# Altium schematic sheet sch smart home.SchDoc
size A; SheetNumber: 1; SheetTotal: 1
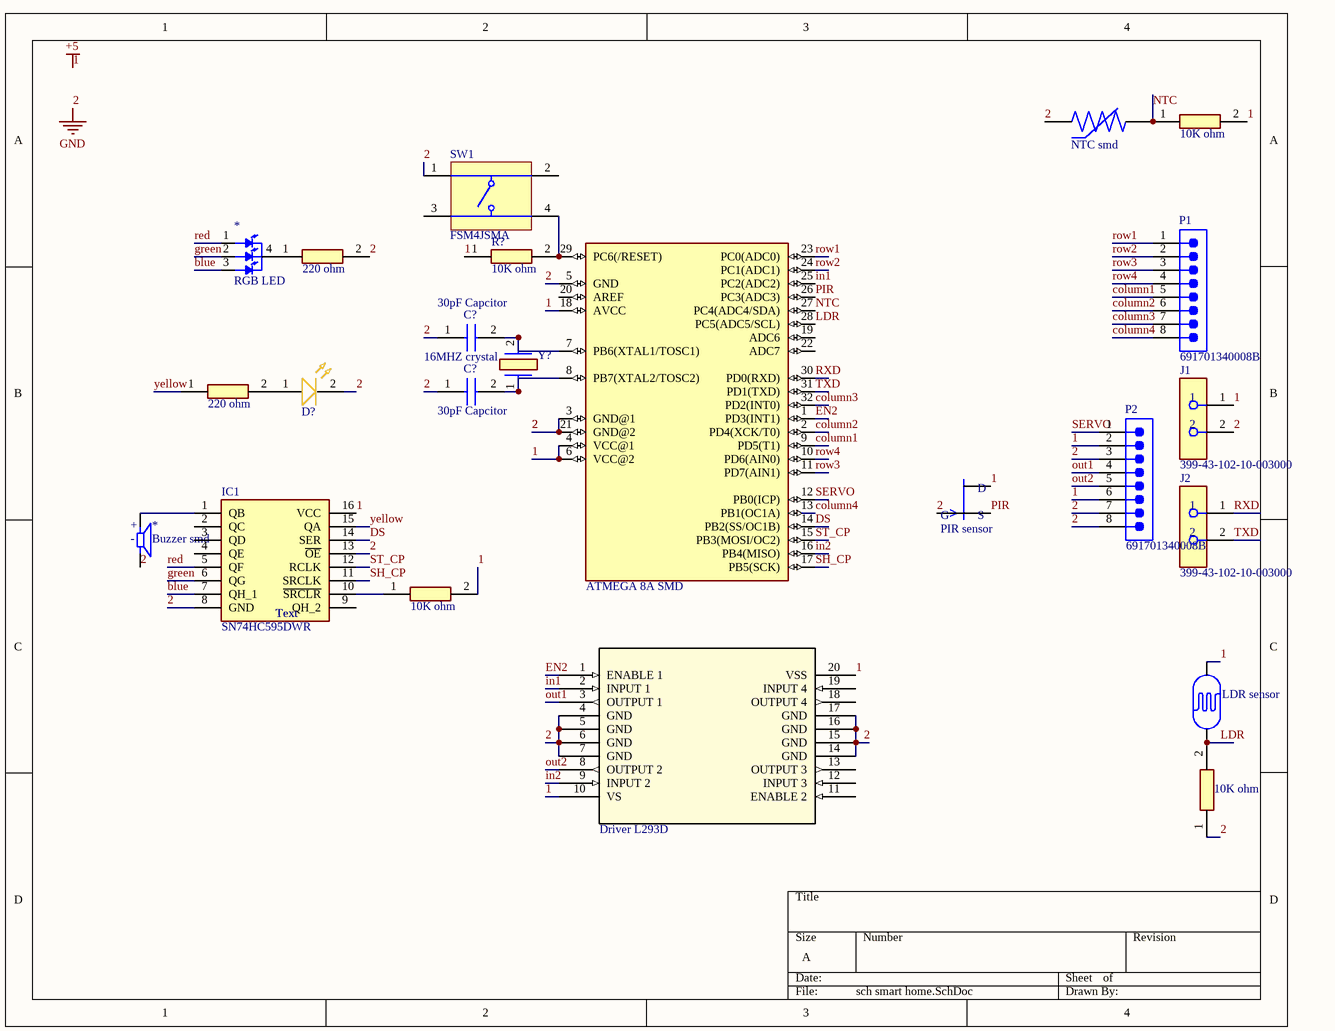
[diagram p0: sch smart home.SchDoc]

## Parts
(Parts that share a designator on the sheet are numbered #1, #2 ... from top to bottom, then left to right.)
*#1  NTC smd  [NTC smd]
*#2  RGB LED  [RGB LED]
*#3  ATMEGA 8A SMD  [ATMEGA 8A SMD]
*#4  PIR sensor  [PIR sensor]
*#5  Buzzer smd  [buzzer smd]
*#6  LDR sensor  [LDR sensor]
*#7  Driver L293D  [L293D]
C?#1  30pF Capcitor  [30pF Capcitor]
C?#2  30pF Capcitor  [30pF Capcitor]
D?  LED  [LED]  (value not drawn)
IC1  SN74HC595DWR  [HC595N]
J1  399-43-102-10-003000  [FP-399-43-102-10-003000-MFG]
J2  399-43-102-10-003000  [FP-399-43-102-10-003000-MFG]
P1  691701340008B  [691701340008B]
P2  691701340008B  [691701340008B]
R#1  10K ohm  [10k OHM]
R#2  220 ohm  [220 OHM]
R#3  220 ohm  [220 OHM]
R#4  10K ohm  [10k OHM]
R#5  10K ohm  [10k OHM]
R?  10K ohm  [10k OHM]
SW1  FSM4JSMA  [TECO-FSM4JSMA_V]
Y?  16MHZ crystal  [16MHZ crystal]

## Nets
1: *#3.4(VCC@1) *#3.6(VCC@2) *#3.18(AVCC) *#4.1(D) *#6.2 *#7.10(VS) *#7.20(VSS) IC1.16(VCC) J1.1 P2.2 P2.6 R#1.2 R#4.2 R?.1  [also labelled +5]
2: *#1.1 *#3.3(GND@1) *#3.5(GND) *#3.21(GND@2) *#4.3(G) *#5.2(N) *#7.4(GND) *#7.5(GND) *#7.6(GND) *#7.7(GND) *#7.14(GND) *#7.15(GND) *#7.16(GND) *#7.17(GND) C?#1.1 C?#2.1 D?.2 IC1.8(GND) IC1.13(~{OE}) J1.2 P2.3 P2.7 P2.8 R#2.2 R#5.1 SW1.1  [also labelled GND]
blue: *#2.3(BLUE) IC1.7(QH_1)
column1: *#3.9(PD5(T1)) P1.5
column2: *#3.2(PD4(XCK/T0)) P1.6
column3: *#3.32(PD2(INT0)) P1.7
column4: *#3.13(PB1(OC1A)) P1.8
DS: *#3.14(PB2(SS/OC1B)) IC1.14(SER)
EN2: *#3.1(PD3(INT1)) *#7.1(ENABLE_1)
green: *#2.2(GREEN) IC1.6(QG)
in1: *#3.25(PC2(ADC2)) *#7.2(INPUT_1)
in2: *#3.16(PB4(MISO)) *#7.9(INPUT_2)
LDR: *#3.28(PC5(ADC5/SCL)) *#6.1 R#5.2
NTC: *#1.2 *#3.27(PC4(ADC4/SDA)) R#1.1
out1: *#7.3(OUTPUT_1) P2.4
out2: *#7.8(OUTPUT_2) P2.5
PIR: *#3.26(PC3(ADC3)) *#4.2(S)
red: *#2.1(RED) IC1.5(QF)
row1: *#3.23(PC0(ADC0)) P1.1
row2: *#3.24(PC1(ADC1)) P1.2
row3: *#3.11(PD7(AIN1)) P1.3
row4: *#3.10(PD6(AIN0)) P1.4
RXD: *#3.30(PD0(RXD)) J2.1
SERVO: *#3.12(PB0(ICP)) P2.1
SH_CP: *#3.17(PB5(SCK)) IC1.11(SRCLK)
ST_CP: *#3.15(PB3(MOSI/OC2)) IC1.12(RCLK)
TXD: *#3.31(PD1(TXD)) J2.2
yellow: IC1.15(QA) R#3.1
Net*#2_4: *#2.4(CATHODE) R#2.1
Net*#3_7: *#3.7(PB6(XTAL1/TOSC1)) C?#1.2 Y?.2
Net*#3_8: *#3.8(PB7(XTAL2/TOSC2)) C?#2.2 Y?.1
Net*#3_29: *#3.29(PC6(/RESET)) R?.2 SW1.4
Net*#5_1: *#5.1(P) IC1.1(QB)
NetD?_1: D?.1 R#3.2
NetIC1_10: IC1.10(~{SRCLR}) R#4.1

Not connected (* = marked no-connect by the designer): *#3 19(ADC6) 20(AREF) 22(ADC7); *#7 11(ENABLE_2) 12(INPUT_3) 13(OUTPUT_3) 18(OUTPUT_4) 19(INPUT_4); IC1 2(QC) 3(QD) 4(QE) 9(QH_2); SW1 2 3

## Notes on the sheet
- (near IC1) Text
- (in symbol Buzzer smd) +; -

## Library data of the parts
*#1 = NTC smd: Manufacturer:: Panasonic Electronic Components; Manufacturer Part Number:: ERT-JZEG103FA; Supplier:: Ultra Librarian; Supplier Part Number:: P124053DKR-ND
*#2 = RGB LED: LED RGB 0404 SMD; Manufacturer:: Cree LED; Manufacturer Product Number:: UHD1110-FKA-CL1A13R3Q1BBQFMF3; Supplier Part Number: UHD1110-FKA-CL1A13R3Q1BBQFMF3DKR-ND; Supplier: SnapMagic
*#4 = PIR sensor: Manufacturer: Zilog; Manufacturer Product Number: ZRE200GE; Supplier:: SnapMagic; Supplier Part Number: 269-4955-ND
*#5 = Buzzer smd: Manufacturer: Murata Electronics; Manufacturer Product Number: PKMCS0909E4000-R1; Supplier: Ultra Librarian; Supplier Part Number: 490-9647-6-ND
*#6 = LDR sensor: PHOTO CELL (CDS PHOTORESISTOR); Manufacturer: Adafruit Industries LLC; Manufacturer Product Number: 161; Supplier: SnapMagic; Supplier Part Number: 1528-2141-ND
*#7 = Driver L293D: IC MTR DRV BIPOLR 4.5-36V 20SOIC; Manufacturer:: STMmicroelectronics; Manufacturer Product Number:: L293DD; Supplier part number: 497-1390-5-ND; Supplier: Ultra librarian
C?#1 C?#2 = 30pF Capcitor: Capacitor; Manufacturer_Name: Kyocera AVX; Manufacturer_Part_Number: 06031A300FAT2A; Datasheet Link: https://componentsearchengine.com/Datasheets/1/06031A100FAT2A.pdf; Height: 0.9mm; Mouser Part Number: 581-06031A300FAT2A; Mouser Price/Stock: https://www.mouser.co.uk/ProductDetail/KYOCERA-AVX/06031A300FAT2A?qs=0IpgBZdgZcpQvPd025dd0w%3D%3D
D? = LED: LED YELLOW CLEAR 0603 SMD; Manufacturer Part Number: 150060AS75000; Manufacturer: Wurth Elektronik; Match Code: WL-SMCW; Case/Size Code: 0603; Chip Technology: AlInGaP; Dominant Wavelength: 605nm; Emitting Color: Amber; Forward Voltage: 2V; Luminous Intensity: 130mcd; Peak Wavelength: 610nm; Viewing Angle: 140°; Category: Signal LEDs; ComponentLink1Description: Website Link; ComponentLink1URL: https://www.we-online.com/redexpert/article/150060AS75000?ad; ComponentLink2Description: Datasheet Link; ComponentLink2URL: https://www.we-online.com/redexpert/spec/150060AS75000?ad; Mount: Surface Mount; Operating Temperature Max: 85°C; Operating Temperature Min: -40°C; Packaging: Tape and Reel; Length: 1.6mm; Width: 0.8mm; Height: 0.7mm; Supplier: SnapMagic; Supplier part Number: 732-12013-6-ND
IC1 = SN74HC595DWR: Integrated Circuit; Manufacturer_Name: Texas Instruments; Manufacturer_Part_Number: SN74HC595DWR; Mouser Part Number: 595-SN74HC595DWR; Supplier Part Number: SN74HC595DWR; Supplier: Texas Instruments
J1 J2 = CMP-07791-000017-1: CONN RCPT 2POS 0.1 GOLD PCB R/A; Pitch: 0.1inch; Connector Type: Receptacle; Number of Positions: 2; Mount: Through Hole; Packaging: Bulk; Color: Black; RoHS Compliant: Yes; Termination: Solder; Number of Rows: 1; Contact Plating: Gold; Package Quantity: 1
P1 P2 = CMP-1502-02009-2: NexarPartId: 22866725; Voltage Rating: 300V; Number of Contacts: 8; Current Rating: 10A; Connector Type: Terminal Block; Gender: Male; REACH SVHC: Unknown; Contact Plating: Tin; RoHS: Compliant; Lead Pitch: 3.81mm; Housing Material: Polymer; Mount: Through Hole; Contact Material: Brass; Termination: PCB; Packaging: Tape and Reel; Color: Black; Number of Pins: 8
R#1 R#4 R#5 R? = 10K ohm: Resistor; Manufacturer_Name: Bourns; Manufacturer_Part_Number: CR2512AJW-103ELF; Datasheet Link: https://www.bourns.com/docs/product-datasheets/crxxxxa.pdf; Height: 0.7mm; Mouser Part Number: 652-CR2512AJW-103ELF; Mouser Price/Stock: https://www.mouser.co.uk/ProductDetail/Bourns/CR2512AJW-103ELF?qs=GedFDFLaBXEqggePGBQmuQ%3D%3D
R#2 R#3 = 220 ohm: Resistor; Manufacturer_Name: Walsin Technology Corporation; Manufacturer_Part_Number: WR08X2200FTL; Datasheet Link: https://www.arrow.com/en/products/wr08x2200ftl/walsin-technology; Arrow Part Number: WR08X2200FTL; Arrow Price/Stock: https://www.arrow.com/en/products/wr08x2200ftl/walsin-technology
SW1 = CMP-2000-05602-2: Swicth, SPST, 24 V, -35 to 85 degC, 4-Pin SMD, RoHS, Tape and Reel; Manufacturer: TE Connectivity; Switch Travel: 0.25mm; Mechanical Life: 100000Cycles; Contact Current Rating: 50mA; Operating Force: 1.57N; Actuator Material: Polyamide; Contact Resistance: 100mOhm; Voltage Rating: 24V; Illumination Type: Illuminated; Actuator Length: 0.055inch; Max Voltage Rating (DC): 12V; Case\/Package: SMD/SMT; Orientation: Straight; Datasheet URL: http://www.te.com/commerce/DocumentDelivery/DDEController?Action=showdoc&DocId=Customer+Drawing%7F2-1437565-7%7FV%7Fpdf%7FEnglish%7FENG_CD_2-1437565-7_V.pdf%7F4-1437565-2; Min Operating Temperature: -35degC; Packaging: LoosePiece; Termination: GullWing; Throw Configuration: SPST; Package Description: 4-Pin Surface Mount Device, Body 6 x 6 mm, Pitch 4.5 mm; Mounting Technology: SurfaceMount; Contact Plating: Silver; Datasheet Version: Rev. V, 02/2015; RoHSCompliant: true; Max Operating Temperature: 85degC; Length: 6mm; Voltage Rating (DC): 24V; Electrical Life: 100000Cycles; Current Rating: 50mA; Package Quantity: 750; Mount: SurfaceMount; Package Reference: FSM4JSMA; Manufacturer URL: http://www.te.com/; Width: 6mm; REACH SVHC: Unknown; Contact Material: CopperAlloy
Y? = 16MHZ crystal: Crystal or Oscillator; Manufacturer_Name: ECS; Manufacturer_Part_Number: ECS-160-20-3X-TR; Datasheet Link: https://www.arrow.com/en/products/ecs-160-20-3x-tr/ecs-international; Height: 2.3mm; Mouser Part Number: 520-160-20-3XT; Mouser Price/Stock: https://www.mouser.co.uk/ProductDetail/ECS/ECS-160-20-3X-TR?qs=7Z%2FjUg96RbU1ElbRFXn8Rw%3D%3D; Arrow Part Number: ECS-160-20-3X-TR; Arrow Price/Stock: https://www.arrow.com/en/products/ecs-160-20-3x-tr/ecs-international?region=nac